# EAGLE design CommunicationShield (EAGLE 8.3.1)
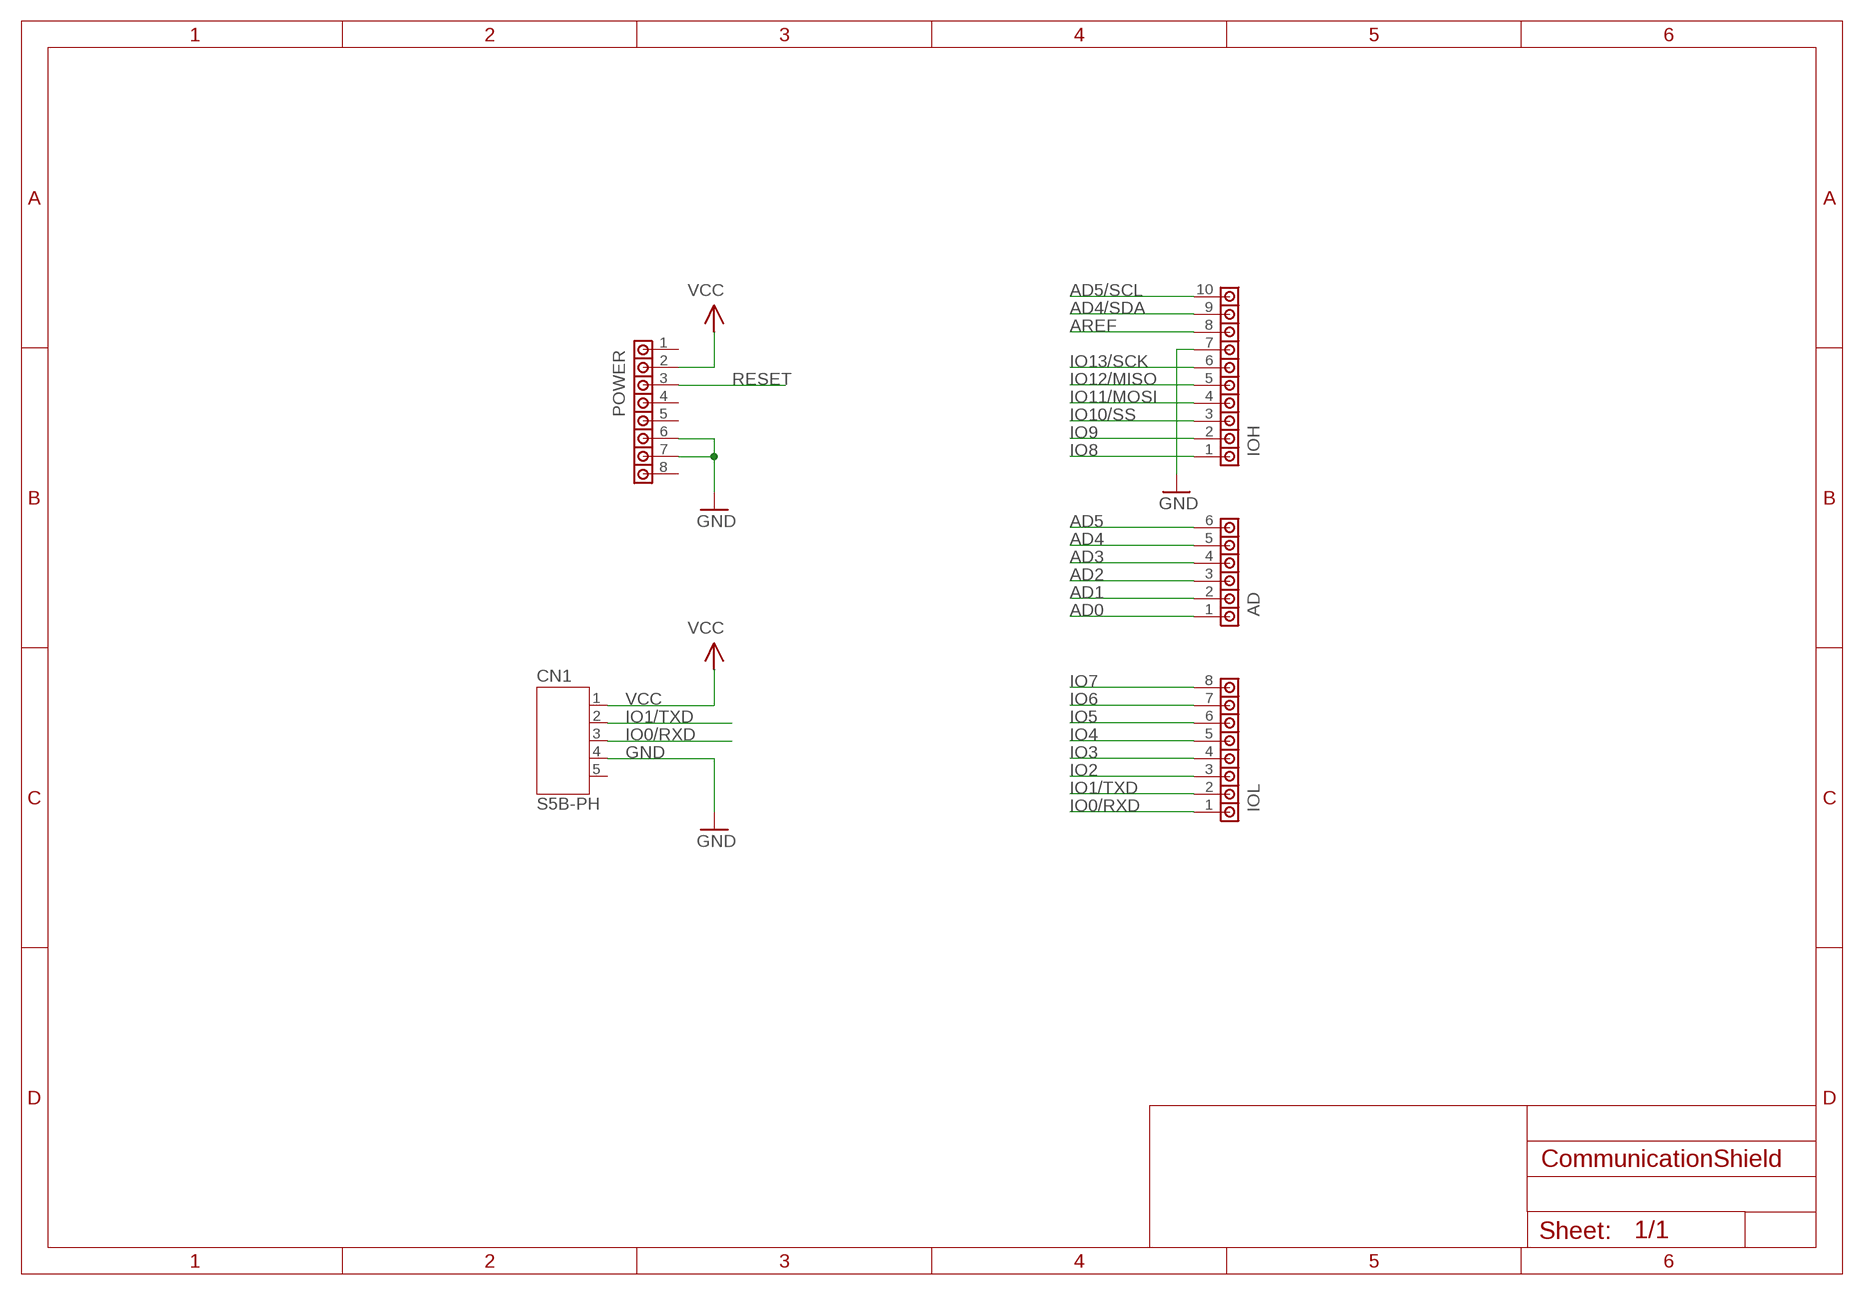
[diagram p0: schematic, sheet 1]

## Parts
AD  PINHD-1X6  [PINHD-1X6]
CN1  S5B-PH  [S5B-PH]
IOH  PINHD-1X10  [PINHD-1X10]
IOL  PINHD-1X8  [PINHD-1X8]
POWER  PINHD-1X8  [PINHD-1X8]

## Nets
AD0: AD.1
AD1: AD.2
AD2: AD.3
AD3: AD.4
AD4: AD.5
AD4/SDA: IOH.9
AD5: AD.6
AD5/SCL: IOH.10
AREF: IOH.8
GND: CN1.4 IOH.7 POWER.6 POWER.7
IO0/RXD: CN1.3 IOL.1
IO1/TXD: CN1.2 IOL.2
IO2: IOL.3
IO3: IOL.4
IO4: IOL.5
IO5: IOL.6
IO6: IOL.7
IO7: IOL.8
IO8: IOH.1
IO9: IOH.2
IO10/SS: IOH.3
IO11/MOSI: IOH.4
IO12/MISO: IOH.5
IO13/SCK: IOH.6
RESET: POWER.3
VCC: CN1.1 POWER.2
Unconnected: CN1.5 POWER.1 POWER.4 POWER.5 POWER.8

## Library data of the parts
AD = misc:PINHD-1X6
CN1 = jst:S5B-PH
IOH = misc:PINHD-1X10
IOL POWER = misc:PINHD-1X8

## Board
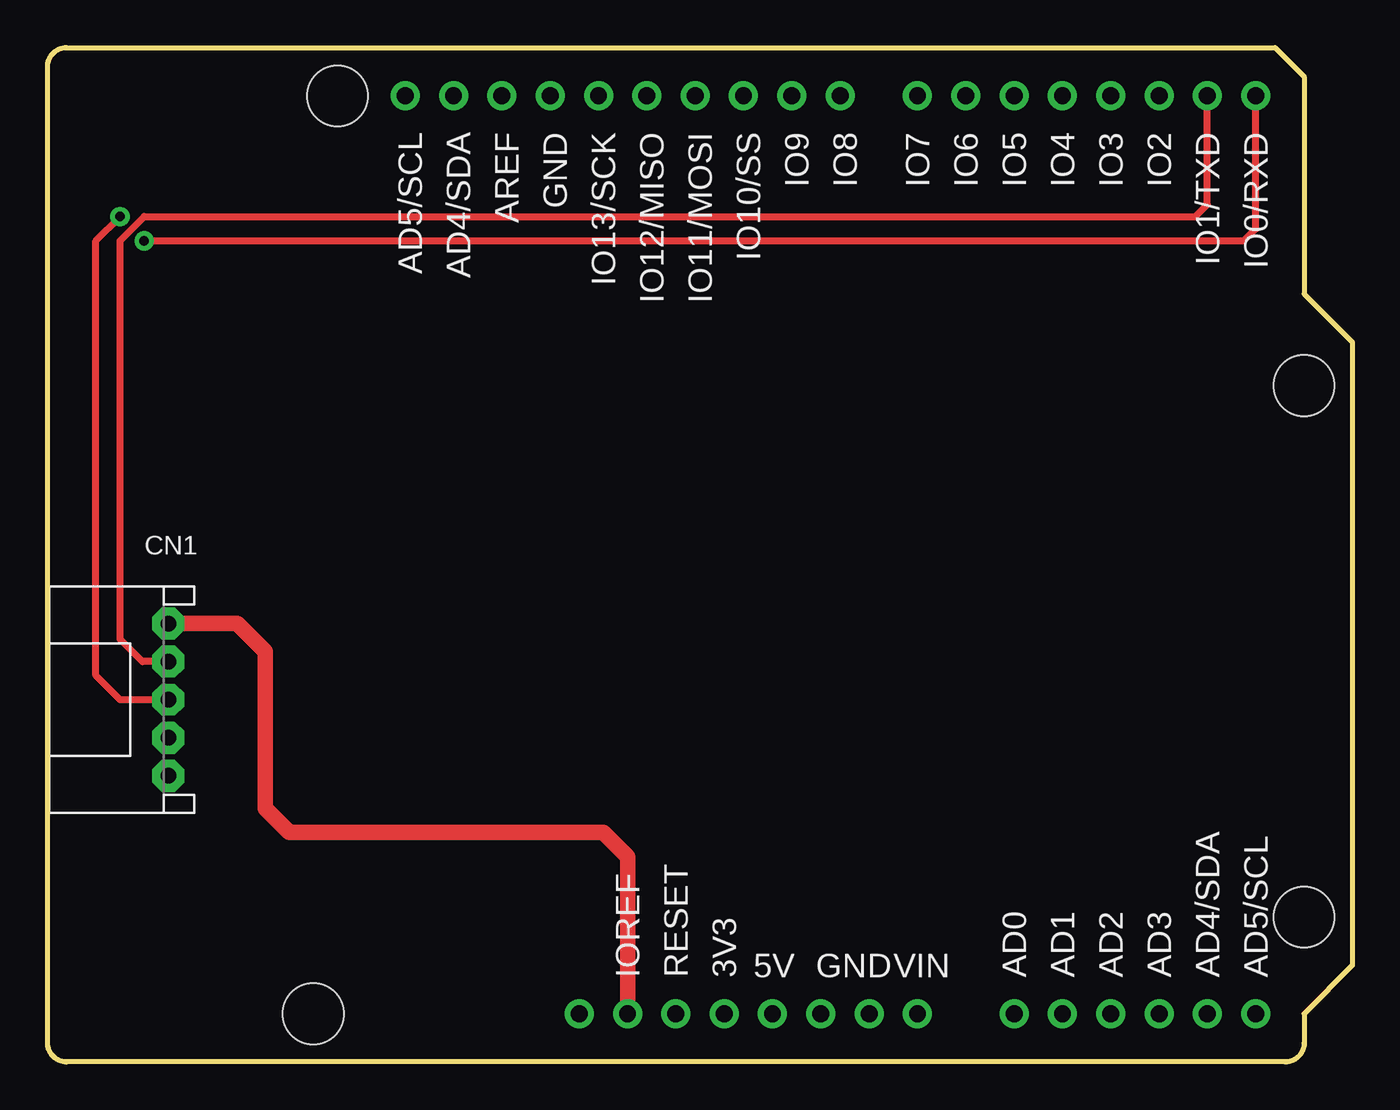
[diagram p1: board, top side]
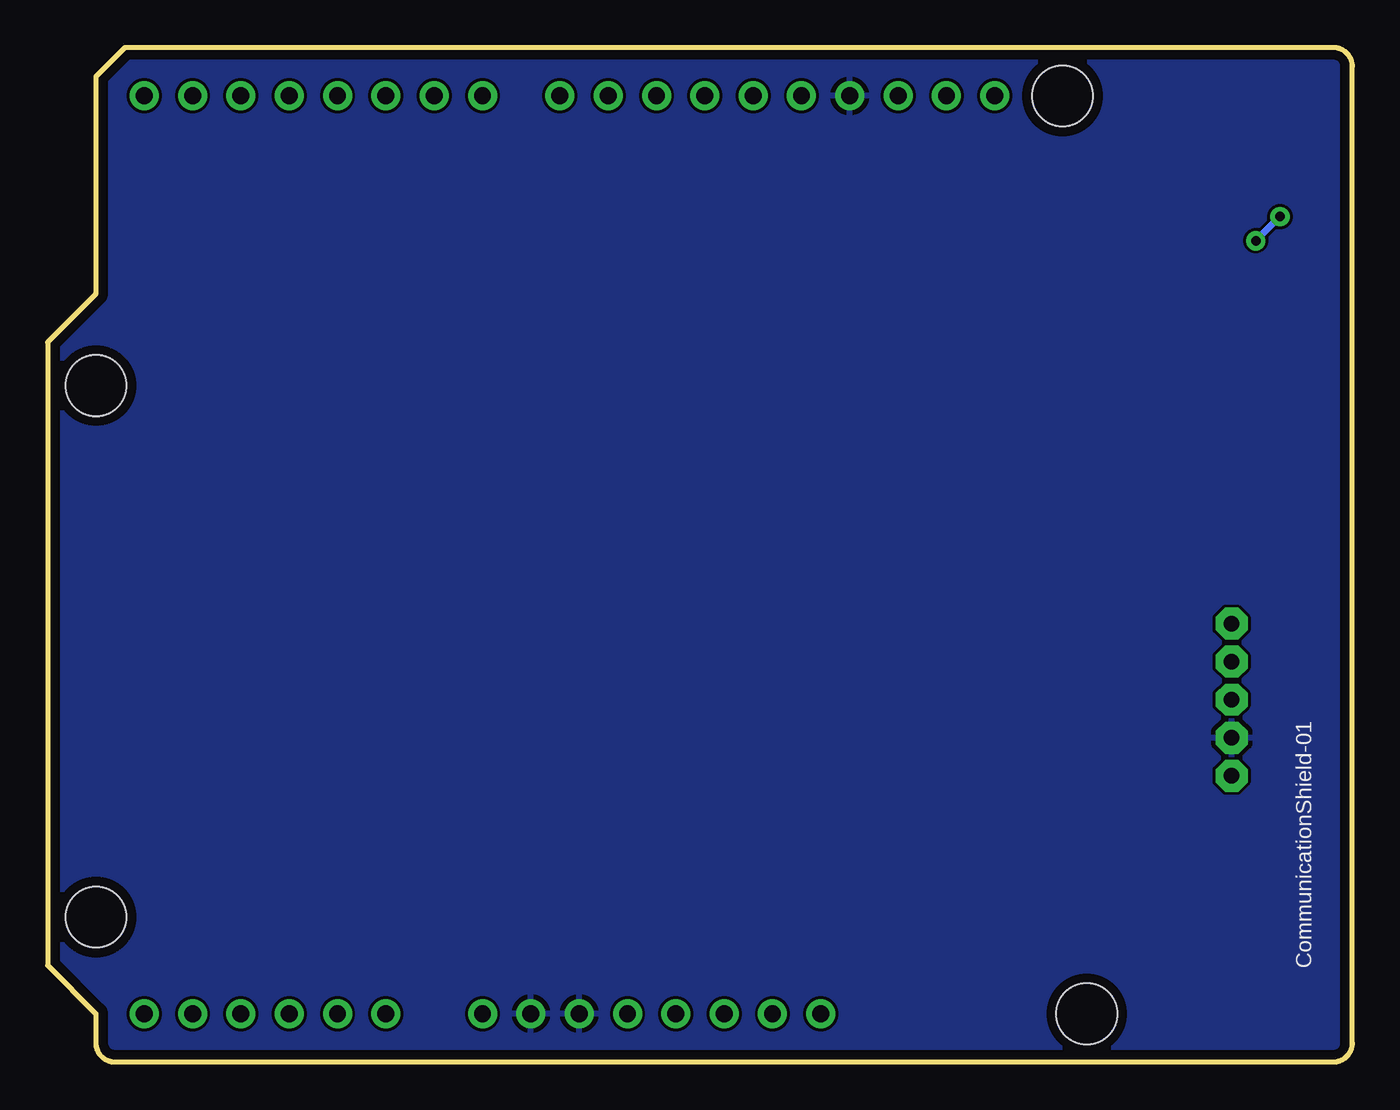
[diagram p2: board, bottom side, seen from below]

Size 68.58 x 53.34 mm. Coordinates in mm from the lower left corner, seen from the top.
Outline: 64.52,53.34 66.04,51.82 66.04,40.39 68.58,37.85 68.58,5.08 66.04,2.54 66.04,1 arc-90 65.04,0 1,0 arc-90 0,1 0,52.34 arc-90 1,53.34 64.52,53.34
Copper layers (1*16): Top 0.035mm / dielectric 1.6mm / Bottom 0.035mm
Design rules "Elecrow_2-layer_PCB_eagle_rule": minimum track width 6mil, minimum drill 12mil, track to track 6mil, track to pad 6mil, pad to pad 6mil, via to via 8mil, smd to smd 0mil, copper to edge 20mil, drill to drill 10mil, minimum pad ring 6mil, minimum via ring 6mil, stop-mask expansion 0mil, vias tented up to drill 100mil, thermal gap 10mil
Holes 3.2 mm at 15.24,50.8 66.04,7.62 66.04,35.56 13.97,2.54

### Footprints (pad centres in the part's own frame; a part is rotated, then mirrored left to right if it is on the bottom)
PINHD-1X6 = drill 0.889 pad 1.524: 1 0,0; 2 0,-2.54; 3 0,-5.08; 4 0,-7.62; 5 0,-10.16; 6 0,-12.7
S5B-PH = drill 0.813 pad 1.676 octagon: 1 -4,0; 2 -2,0; 3 0,0; 4 2,0; 5 4,0
PINHD-1X10 = drill 0.889 pad 1.524: 1 0,0; 2 0,-2.54; 3 0,-5.08; 4 0,-7.62; 5 0,-10.16; 6 0,-12.7; 7 0,-15.24; 8 0,-17.78; 9 0,-20.32; 10 0,-22.86
PINHD-1X8 = drill 0.889 pad 1.524: 1 0,0; 2 0,-2.54; 3 0,-5.08; 4 0,-7.62; 5 0,-10.16; 6 0,-12.7; 7 0,-15.24; 8 0,-17.78

### Placement (x,y rotation side)
AD  50.8,2.54 90 top
CN1  6.35,19.05 270 top
IOH  41.66,50.8 270 top
IOL  63.5,50.8 270 top
POWER  27.94,2.54 90 top

### Tracks (layer width: path | path; a pad name or v marks a point on that pad's centre or on a via)
GND
  pour Bottom: -1.27,54.61 69.85,54.61 69.85,-2.54 -1.27,-2.54
IO0/RXD  (via drill 0.5 pad 1.02)
  Top 0.381: v3.81,44.45 2.54,43.18 2.54,20.32 3.81,19.05 CN1.3 | v5.08,43.18 62.87,43.18 63.5,43.81 IOL.1
  Bottom 0.381: v3.81,44.45 v5.08,43.18
IO1/TXD
  Top 0.381: IOL.2 60.96,45.09 60.33,44.45 5.08,44.45 3.81,43.18 3.81,22.23 4.99,21.05 CN1.2
VCC
  Top 0.813: POWER.2 30.48,10.79 29.21,12.06 12.7,12.06 11.43,13.34 11.43,21.59 9.97,23.05 CN1.1

### Text on the board
tPlace: IO13/SCK | IO12/MISO | IO11/MOSI | IO10/SS | IO9 | IO8 | IO7 | IO6 | IO5 | IO4 | IO3 | IO2 | IO1/TXD | IO0/RXD
tNames: AD5/SCL | AD4/SDA | AREF | GND | IOREF | RESET | 3V3 | 5V | GND | VIN | AD0 | AD1 | AD2 | AD3 | AD4/SDA | AD5/SCL
bNames: CommunicationShield-01